# EAGLE design Esquema2 (EAGLE 9.2.0)
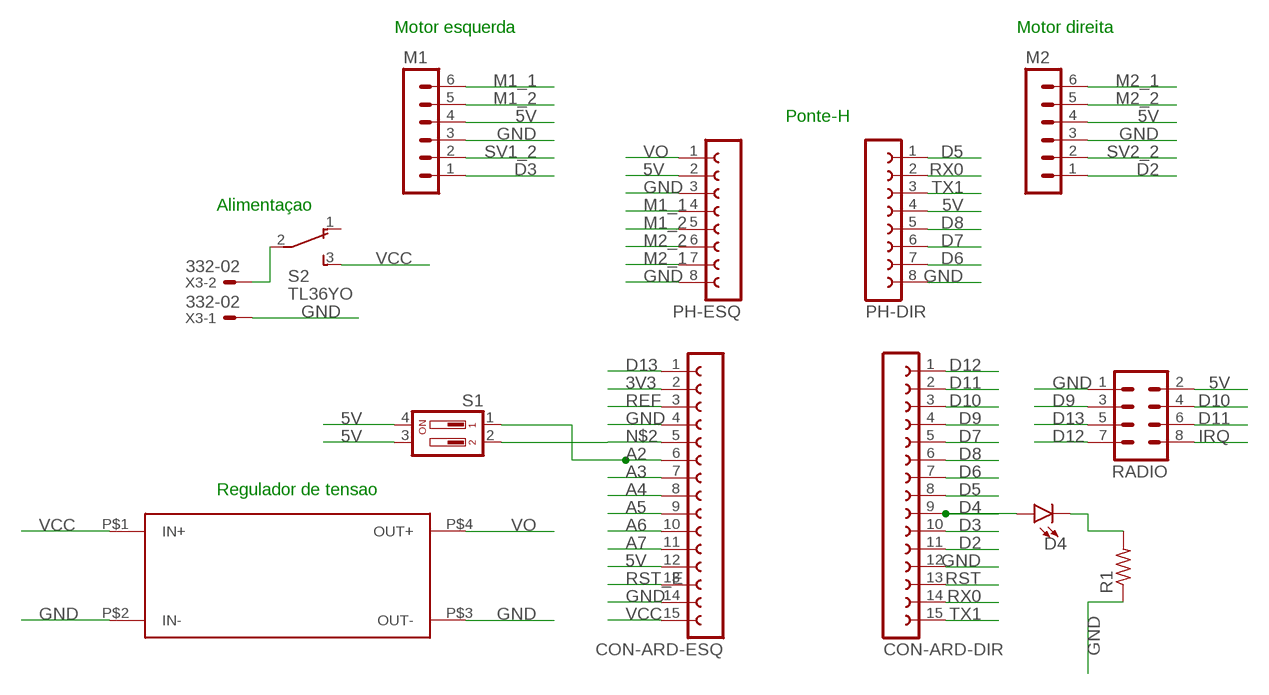
[diagram p0: schematic, sheet 1]

## Parts
CON-ARD-DIR  FE15-1  [FE15]
CON-ARD-ESQ  FE15-1  [FE15]
D4  LED-3MM-NO_SILK  [LED_3MM-NS]
M1  MA06-1  [MA06-1]
M2  MA06-1  [MA06-1]
PH-DIR  FE08-1  [FE08]
PH-ESQ  FE08-1  [FE08]
R1  R-US_0207/12  [0207/12]
RADIO  MA04-2  [MA04-2]
S1  DA02  [DA-02]
S2  TL36YO  [TL3XYO]
U$1  REGULADOR  [REGULADOR-FP]
X3  332-02  [332-02]

## Nets
3V3: CON-ARD-ESQ.2
5V: CON-ARD-ESQ.12 M1.4 M2.4 PH-DIR.4 PH-ESQ.2 RADIO.2 S1.3 S1.4
A2: CON-ARD-ESQ.6 S1.1
A3: CON-ARD-ESQ.7
A4: CON-ARD-ESQ.8
A5: CON-ARD-ESQ.9
A6: CON-ARD-ESQ.10
A7: CON-ARD-ESQ.11
D2: CON-ARD-DIR.11 M2.1
D3: CON-ARD-DIR.10 M1.1
D4: CON-ARD-DIR.9 D4.A
D5: CON-ARD-DIR.8 PH-DIR.1
D6: CON-ARD-DIR.7 PH-DIR.7
D7: CON-ARD-DIR.5 PH-DIR.6
D8: CON-ARD-DIR.6 PH-DIR.5
D9: CON-ARD-DIR.4 RADIO.3
D10: CON-ARD-DIR.3 RADIO.4
D11: CON-ARD-DIR.2 RADIO.6
D12: CON-ARD-DIR.1 RADIO.7
D13: CON-ARD-ESQ.1 RADIO.5
GND: CON-ARD-DIR.12 CON-ARD-ESQ.4 CON-ARD-ESQ.14 M1.3 M2.3 PH-DIR.8 PH-ESQ.3 PH-ESQ.8 R1.1 RADIO.1 U$1.P$2(IN-) U$1.P$3(OUT-) X3.1
IRQ: RADIO.8
M1_1: M1.6 PH-ESQ.4
M1_2: M1.5 PH-ESQ.5
M2_1: M2.6 PH-ESQ.7
M2_2: M2.5 PH-ESQ.6
N$1: S2.2(P) X3.2
N$2: CON-ARD-ESQ.5 S1.2
N$5: D4.K(C) R1.2
REF: CON-ARD-ESQ.3
RST: CON-ARD-DIR.13
RST_E: CON-ARD-ESQ.13
RX0: CON-ARD-DIR.14 PH-DIR.2
SV1_2: M1.2
SV2_2: M2.2
TX1: CON-ARD-DIR.15 PH-DIR.3
VCC [VCC]: CON-ARD-ESQ.15 S2.3(S) U$1.P$1(IN+)
VO: PH-ESQ.1 U$1.P$4(OUT+)
Unconnected: S2.1(O)

## Notes on the sheet
- Motor esquerda | Motor direita
- Ponte-H
- Alimentaçao
- Regulador de tensao

## Library data of the parts
CON-ARD-DIR = con-lsta:FE15-1: FEMALE HEADER; OC_FARNELL: unknown; OC_NEWARK: unknown
CON-ARD-ESQ = con-lsta:FE15-1: FEMALE HEADER; OC_FARNELL: unknown; OC_NEWARK: unknown; SPICEPREFIX: X
D4 = SparkFun-LED:LED: LED (Generic) Standard schematic elements and footprints for 5mm, 3mm, 1206, and 0603 sized LEDs. Generic LEDs with no color specified.
M1 M2 = con-lstb:MA06-1: PIN HEADER; OC_FARNELL: unknown; OC_NEWARK: unknown
PH-DIR PH-ESQ = con-lsta:FE08-1: FEMALE HEADER; OC_FARNELL: unknown; OC_NEWARK: unknown
R1 = resistor:R-US_: RESISTOR, American symbol
RADIO = con-lstb:MA04-2: PIN HEADER; OC_FARNELL: unknown; OC_NEWARK: unknown
S1 = switch-dil:DA02: DIL/CODE SWITCH; OC_FARNELL: 1255229; OC_NEWARK: unknown
S2 = switch:TL36YO: TINY SWITCH ON - ON Source: http://www2.produktinfo.conrad.com/datenblaetter/700000-724999/705152-da-01-de-Subminiaturschalter_TL_36YO.pdf
U$1 = robo-bdp:REGULADOR
X3 = con-garry:332-02: 2 Pin - 2mm Dual Row Source: www.mpe-connector.de / garry_shortform_2012.pdf

## Net classes
0 default: width 1 mm
1 VCC: width 1 mm

## Board
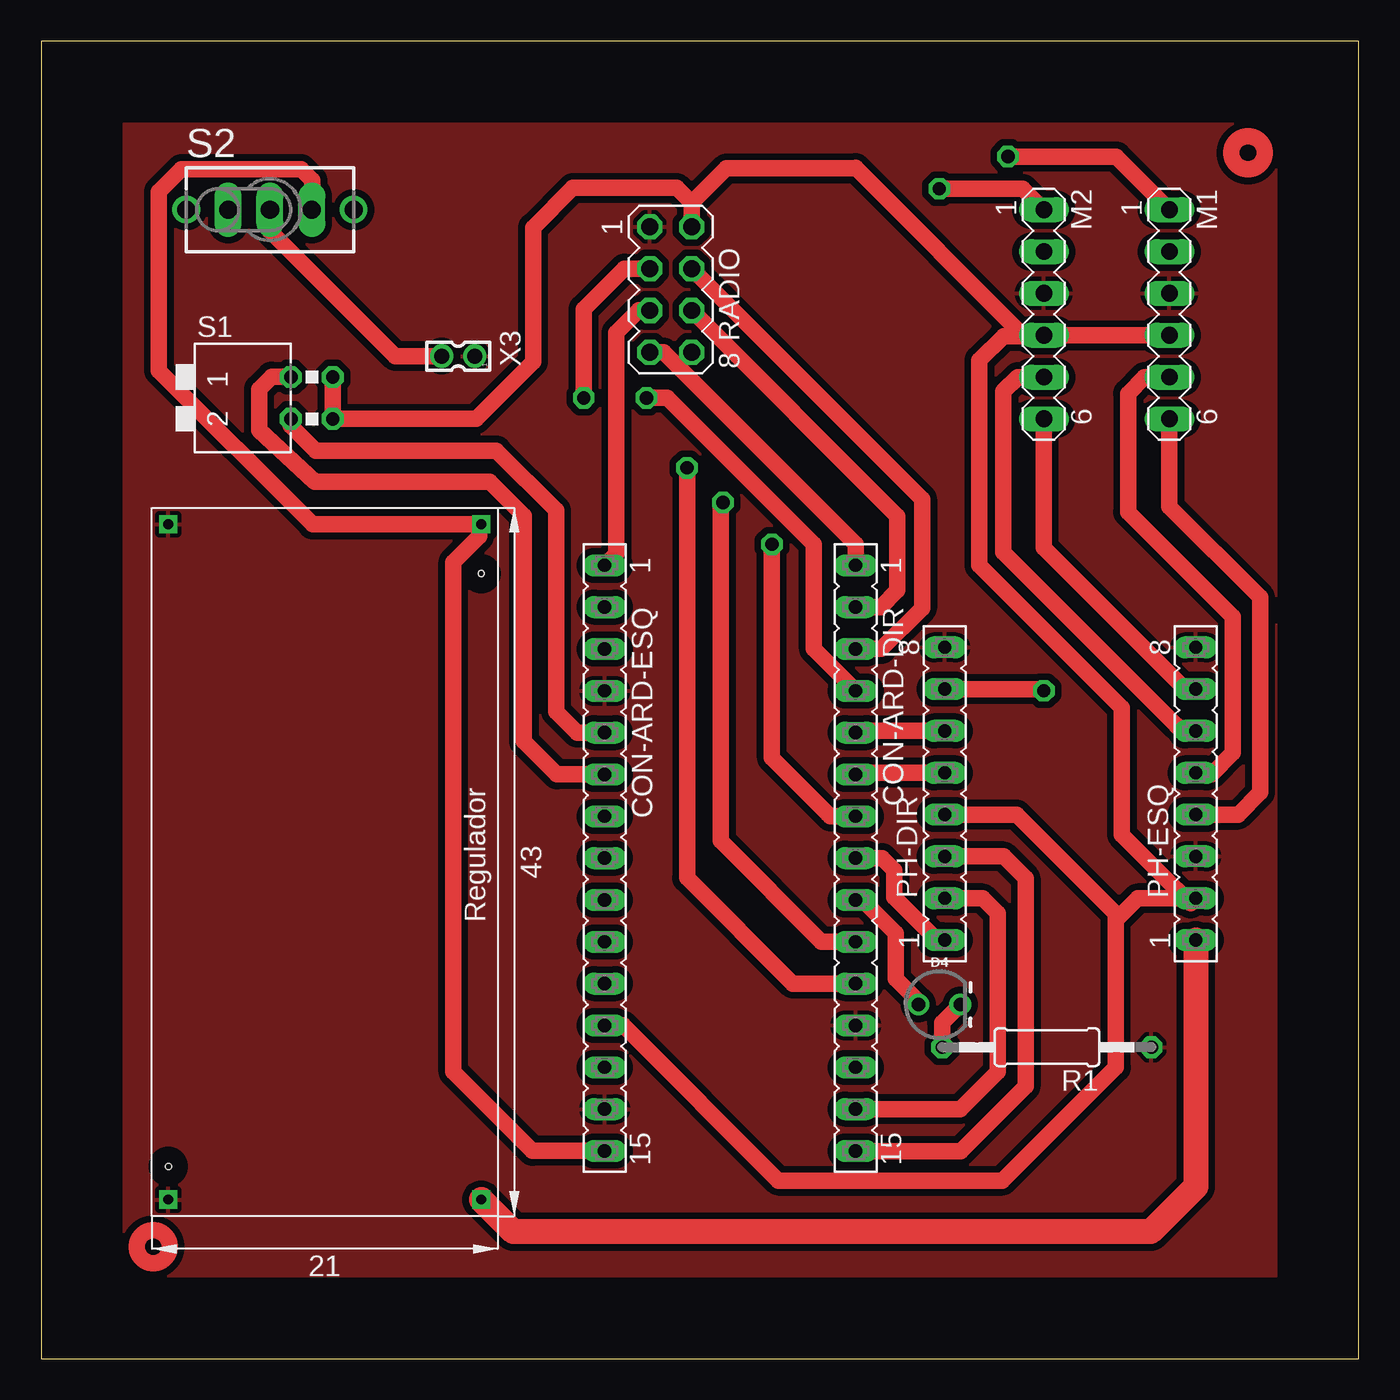
[diagram p1: board, top side]
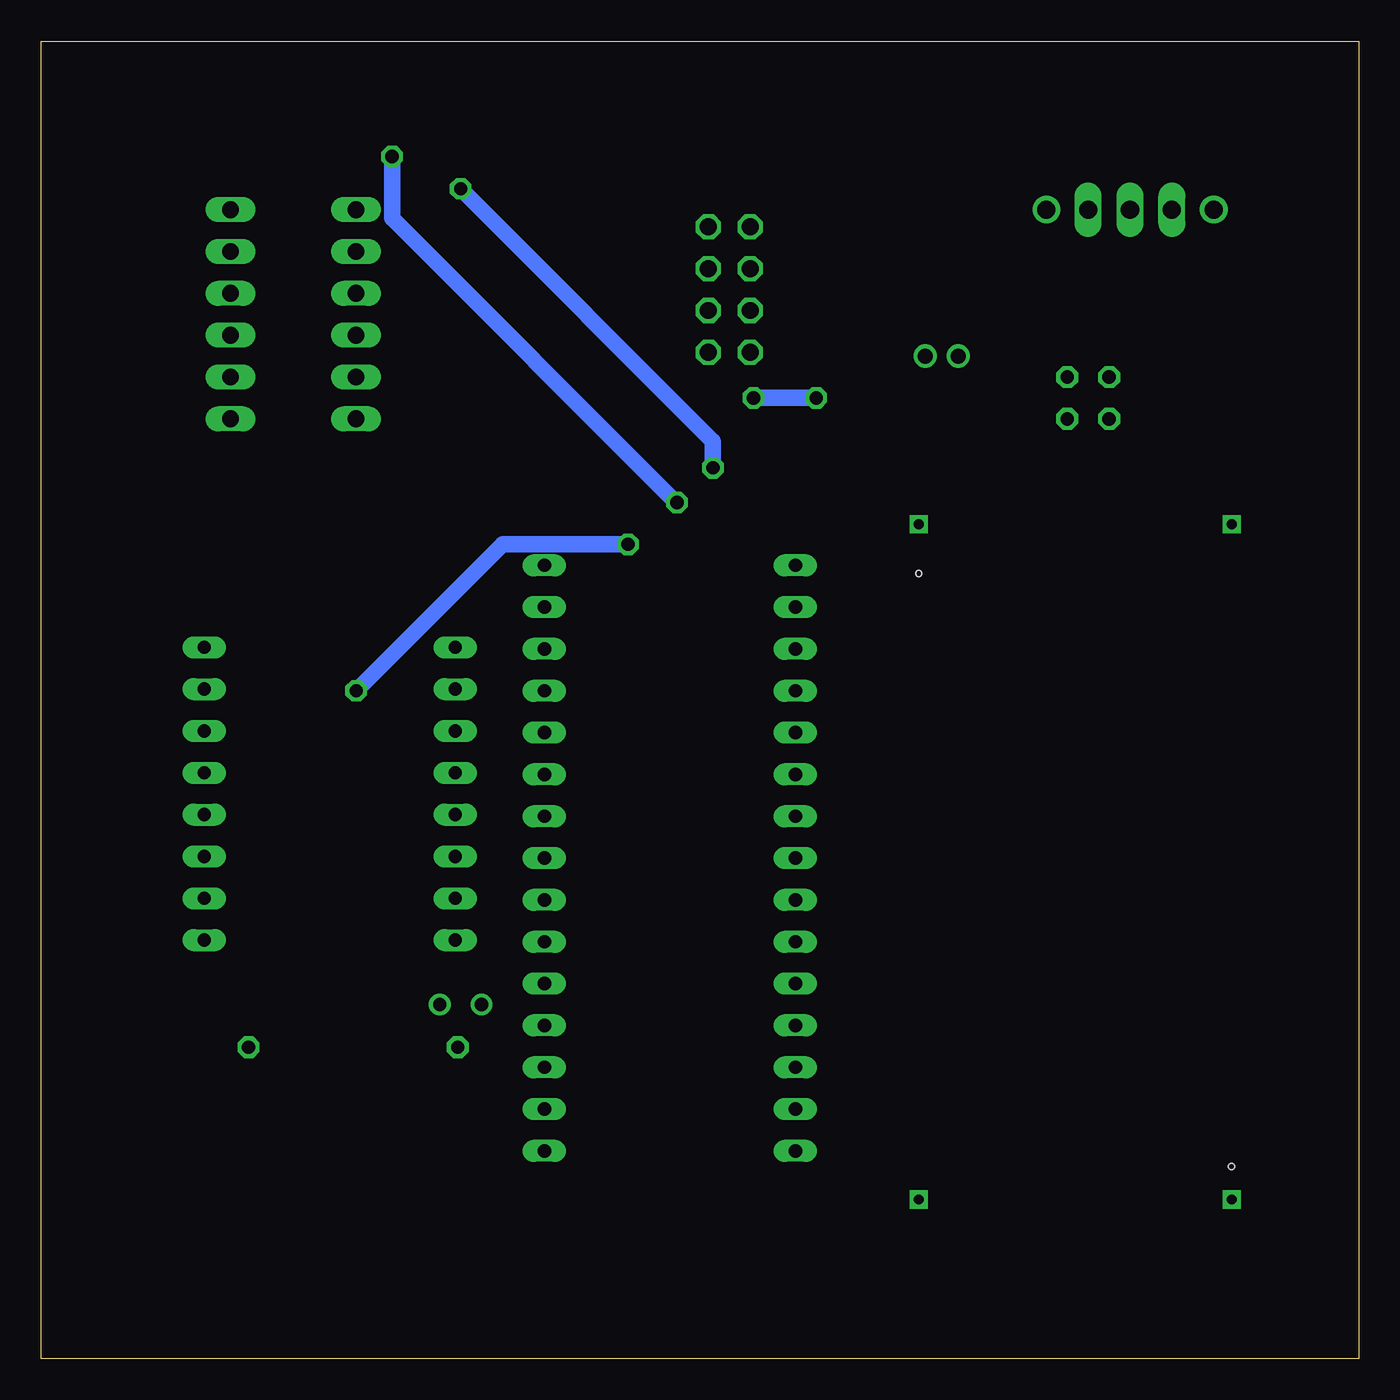
[diagram p2: board, bottom side, seen from below]

Size 80 x 80 mm. Coordinates in mm from the lower left corner, seen from the top.
Outline: 0,0 80,0 80,80 0,80 0,0
Copper layers (1*16): Top 0.035mm / dielectric 1.5mm / Bottom 0.035mm
Design rules "default *": minimum track width 6mil, minimum drill 0.35mm, track to track 16mil, track to pad 16mil, pad to pad 16mil, via to via 6mil, smd to smd 6mil, copper to edge 40mil, drill to drill 6mil, minimum pad ring 10mil, minimum via ring 8mil, stop-mask expansion 4mil, vias tented up to drill 0mil, thermal gap 10mil

### Footprints (pad centres in the part's own frame; a part is rotated, then mirrored left to right if it is on the bottom)
FE15 = drill 0.813 long: 1 -17.78,0; 2 -15.24,0; 3 -12.7,0; 4 -10.16,0; 5 -7.62,0; 6 -5.08,0; 7 -2.54,0; 8 0,0; 9 2.54,0; 10 5.08,0; 11 7.62,0; 12 10.16,0; 13 12.7,0; 14 15.24,0; 15 17.78,0
LED_3MM-NS = drill 0.813: A -1.27,0; K 1.27,0
MA06-1 = drill 1.016 long: 1 -6.35,0; 2 -3.81,0; 3 -1.27,0; 4 1.27,0; 5 3.81,0; 6 6.35,0
FE08 = drill 0.813 long: 1 -8.89,0; 2 -6.35,0; 3 -3.81,0; 4 -1.27,0; 5 1.27,0; 6 3.81,0; 7 6.35,0; 8 8.89,0
0207/12 = drill 0.813 octagon: 1 -6.35,0; 2 6.35,0
MA04-2 = drill 1.016 octagon: 1 -3.81,-1.27; 2 -3.81,1.27; 3 -1.27,-1.27; 4 -1.27,1.27; 5 1.27,-1.27; 6 1.27,1.27; 7 3.81,-1.27; 8 3.81,1.27
DA-02 = drill 0.813 octagon: 1 -1.27,-1.27; 2 1.27,-1.27; 3 1.27,1.27; 4 -1.27,1.27
TL3XYO = drill 1.1 pad 1.422 long: 1 -2.54,0; 2 0,0; 3 2.54,0 | drill 1.1 pad 1.676: M1 -5.08,0; M2 5.08,0
REGULADOR-FP = drill 0.6 square: P$1 -19,3; P$2 -19,-16; P$3 22,-16; P$4 22,3 | hole 0.35: -16,3; 20,-16
332-02 = drill 0.9 pad 1.27: 1 0,-1; 2 0,1

### Placement (x,y rotation side)
CON-ARD-DIR  49.45,30.4 270 top
CON-ARD-ESQ  34.21,30.4 270 top
D4  54.53,21.51 0 top
M1  68.5,63.42 270 top
M2  60.88,63.42 270 top
PH-DIR  54.86,34.31 90 top
PH-ESQ  70.1,34.31 90 top
R1  61.06,18.92 180 top
RADIO  38.22,64.92 270 top
S1  16.43,58.34 270 top
S2  13.89,69.77 0 top
U$1  23.72,31.67 270 top
X3  25.32,60.88 90 top

### Tracks (layer width: path | path; a pad name or v marks a point on that pad's centre or on a via)
5V
  Top 1: M2.4 60.82,62.09 58.43,62.09 56.97,60.63 56.97,48.18 65.61,39.53 65.61,31.82 68.91,28.52 69.79,27.65 PH-ESQ.2 66.57,27.96 65.25,26.64 | M2.4 59.61,62.15 49.45,72.31 49.42,72.28 41.6,72.28 39.49,70.18 | M2.4 M1.4 | S1.4 S1.3 26.41,57.07 29.87,60.52 29.87,68.68 32.28,71.09 38.58,71.09 39.49,70.18 | 39.49,70.18 RADIO.2 | CON-ARD-ESQ.12 35.33,20.24 44.75,10.82 58.37,10.82 65.25,17.7 65.25,26.64 | 65.25,26.64 65.25,27.02 59.23,33.04 PH-DIR.4
A2
  Top 1: CON-ARD-ESQ.6 31.31,35.48 29.31,37.49 29.31,51.18 27.23,53.26 16.61,53.26 13.23,56.38 13.23,58.87 13.99,59.63 15.13,59.63 S1.1
D2  (via drill 0.8 pad 1.3)
  Top 1: M2.1 59.61,71.04 v54.53,71.04 | v39.21,54.1 39.21,29.21 45.64,22.78 CON-ARD-DIR.11
  Bottom 1: v54.53,71.04 39.21,55.72 v39.21,54.1
D3  (via drill 0.8 pad 1.3)
  Top 1: CON-ARD-DIR.10 47.37,25.32 41.25,31.44 41.25,51.84 v41.4,51.99 | v58.7,73 65.27,73 M1.1
  Bottom 1: v41.4,51.99 41.45,51.99 58.7,69.24 v58.7,73
D4
  Top 1: CON-ARD-DIR.9 49.86,27.86 51.89,25.83 51.89,23.07 53.26,21.7 D4.A
D5
  Top 1: 54.68,25.6 PH-DIR.1 54.4,25.42 51.79,28.04 51.79,29.66 51.05,30.4 CON-ARD-DIR.8
D6  (via drill 0.8 pad 1.3)
  Top 1: CON-ARD-DIR.7 47.91,32.94 47.75,33.1 44.37,36.48 v44.37,49.45 | v60.88,40.56 60.78,40.66 PH-DIR.7
  Bottom 1: v44.37,49.45 51.99,49.45 v60.88,40.56
D7
  Top 1: PH-DIR.6 49.55,38.12 CON-ARD-DIR.5
D8
  Top 1: PH-DIR.5 49.55,35.58 CON-ARD-DIR.6
D9  (via drill 0.8 pad 1.3)
  Top 1: 36.98,66.13 36.98,66.16 RADIO.3 35.4,66.19 32.94,63.73 v32.94,58.34 | CON-ARD-DIR.4 46.91,43.1 46.91,49.45 38.02,58.34 v36.75,58.34
  Bottom 1: v36.75,58.34 v32.94,58.34
D10
  Top 1: CON-ARD-DIR.3 51.01,43.1 53.49,45.58 53.49,52.19 RADIO.4
D11
  Top 1: CON-ARD-DIR.2 50.96,45.64 50.97,45.65 51.98,46.66 51.98,51.16 RADIO.6
D12
  Top 1: CON-ARD-DIR.1 49.45,49.45 37.79,61.11 RADIO.7
D13
  Top 1: RADIO.5 36.27,63.65 34.92,62.3 34.92,48.89 CON-ARD-ESQ.1
GND
  pour Top: 5,5 5,75 75,75 75,5
M1_1
  Top 1: 70.18,33.12 PH-ESQ.4 72.67,33.04 74.01,34.39 74.01,44.65 74.01,46.22 68.5,51.74 M1.6
M1_2
  Top 1: M1.5 66.99,59.6 65.99,58.61 65.99,51.41 72.35,45.05 72.35,36.79 71.06,35.5 71.01,35.56 70.12,35.56 PH-ESQ.5
M2_1
  Top 1: PH-ESQ.7 69.98,40.54 69.59,40.54 60.88,49.26 M2.6
M2_2
  Top 1: PH-ESQ.6 69.27,38.12 68.9,38.49 58.42,48.97 58.42,58.73 59.3,59.61 M2.5
N$1
  Top 1: S2.2 13.89,68.5 21.51,60.88 X3.2
N$2
  Top 1: S1.2 15.16,56.64 16.66,55.14 27.63,55.14 31.26,51.51 31.26,39.29 32.53,38.02 CON-ARD-ESQ.5
N$5
  Top 1: D4.K 54.71,20.42 R1.2
RX0
  Top 1: PH-DIR.2 57.16,27.96 58.08,27.05 58.08,17.44 55.8,15.16 CON-ARD-DIR.14
TX1
  Top 1: CON-ARD-DIR.15 49.47,12.6 55.82,12.6 59.76,16.54 59.76,29.17 58.43,30.5 PH-DIR.3
VCC
  Top 1: S2.3 16.46,69.8 16.46,71.55 15.78,72.22 8.51,72.22 7.15,70.86 7.15,60 16.48,50.67 26.59,50.67 | 26.59,50.67 U$1.P$1 | CON-ARD-ESQ.15 29.83,12.62 25.03,17.42 25.03,48.37 26.59,49.93 26.59,50.67
VO
  Top 1.524: U$1.P$4 28.67,7.72 67.36,7.72 70.1,10.46 PH-ESQ.1
(copper drawn outside any net)
  shapes: Top circle x2